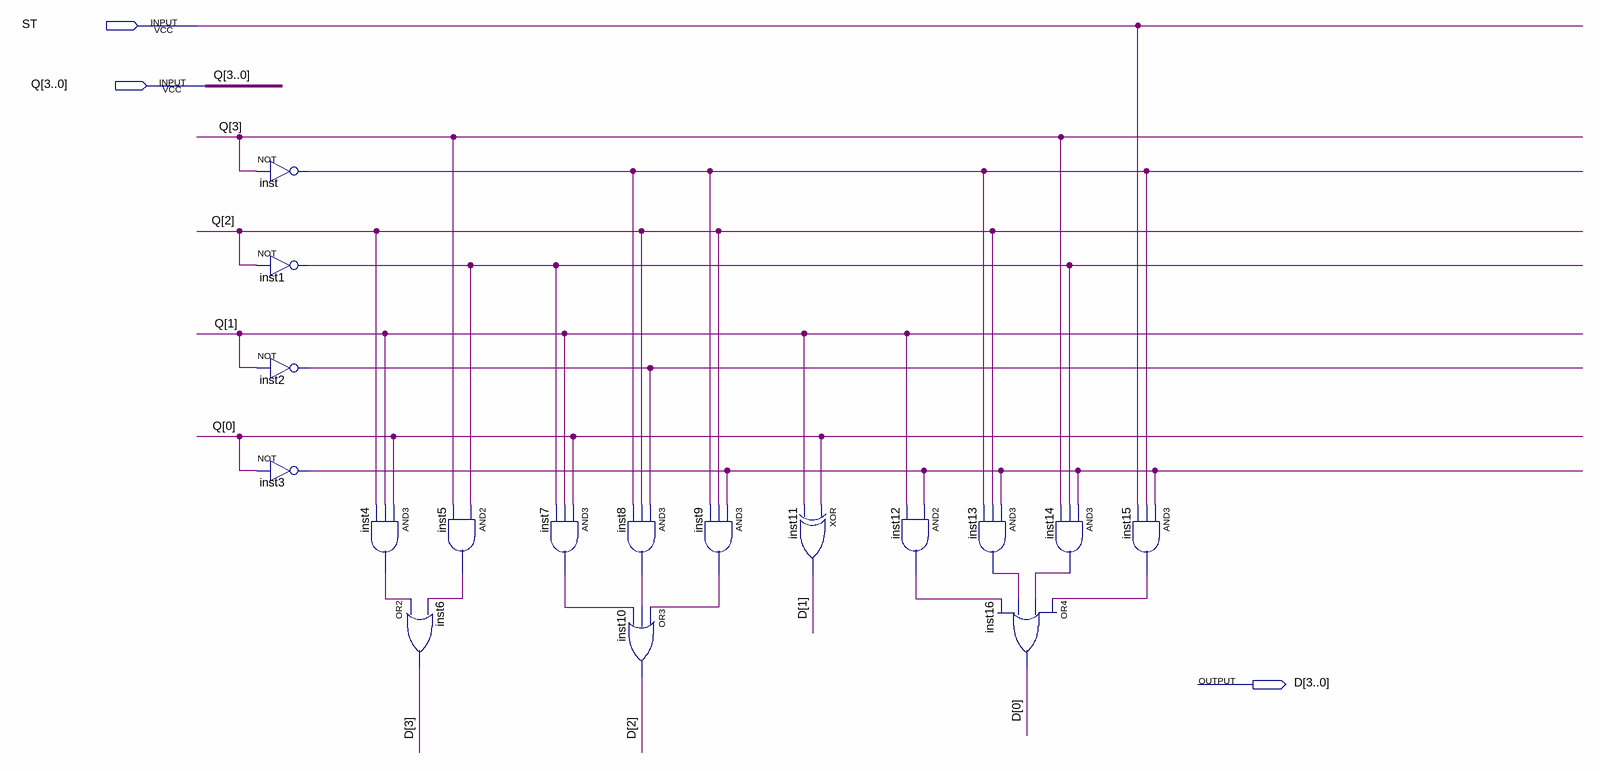
[diagram p0: schematic sheet]
// Quartus schematic NEXT_STATE.bdf as structural Verilog: 17 symbols, 3 pins
module NEXT_STATE (
  input  ST,
  input  [3:0] Q,
  output [3:0] D
);

  wire inst1_out, inst2_out, inst3_out, inst4_out, inst5_out, inst7_out, inst8_out, inst9_out, inst12_out,
       inst13_out, inst14_out, inst15_out, inst_out;

  not inst (inst_out, Q[3]);
  not inst1 (inst1_out, Q[2]);
  not inst2 (inst2_out, Q[1]);
  not inst3 (inst3_out, Q[0]);
  and inst4 (inst4_out, Q[0], Q[1], Q[2]);
  or inst6 (D[3], inst4_out, inst5_out);
  and inst5 (inst5_out, inst1_out, Q[3]);
  and inst7 (inst7_out, Q[0], Q[1], inst1_out);
  and inst8 (inst8_out, inst2_out, Q[2], inst_out);
  or inst10 (D[2], inst9_out, inst8_out, inst7_out);
  and inst9 (inst9_out, inst3_out, Q[2], inst_out);
  xor inst11 (D[1], Q[0], Q[1]);
  and inst12 (inst12_out, inst3_out, Q[1]);
  and inst13 (inst13_out, inst3_out, Q[2], inst_out);
  or inst16 (D[0], inst15_out, inst14_out, inst13_out, inst12_out);
  and inst14 (inst14_out, inst3_out, inst1_out, Q[3]);
  and inst15 (inst15_out, inst3_out, inst_out, ST);
endmodule
